# Altium schematic sheet design_1.SchDoc: design
size 414 x 279 mm; Date: 1/25/2021 11:39:22 PM; SheetNumber: 2; Origin: Eagle; GateName_1: G$1; SymbolName_1: A3-L-GUMSTIX; LibraryName: qualified_1; DeviceSetName: A3-L-GUMSTIX; A: A; B: B; C: C; D: D; E: E; F: F; G: G; H: H; 1: 1; 2: 2; 3: 3; 4: 4; 5: 5; Sheet: Sheet:; C:/Gumstix/gumstix-logo-16.bmp: C:/Gumstix/gumstix-logo-16.bmp; Board: Board:
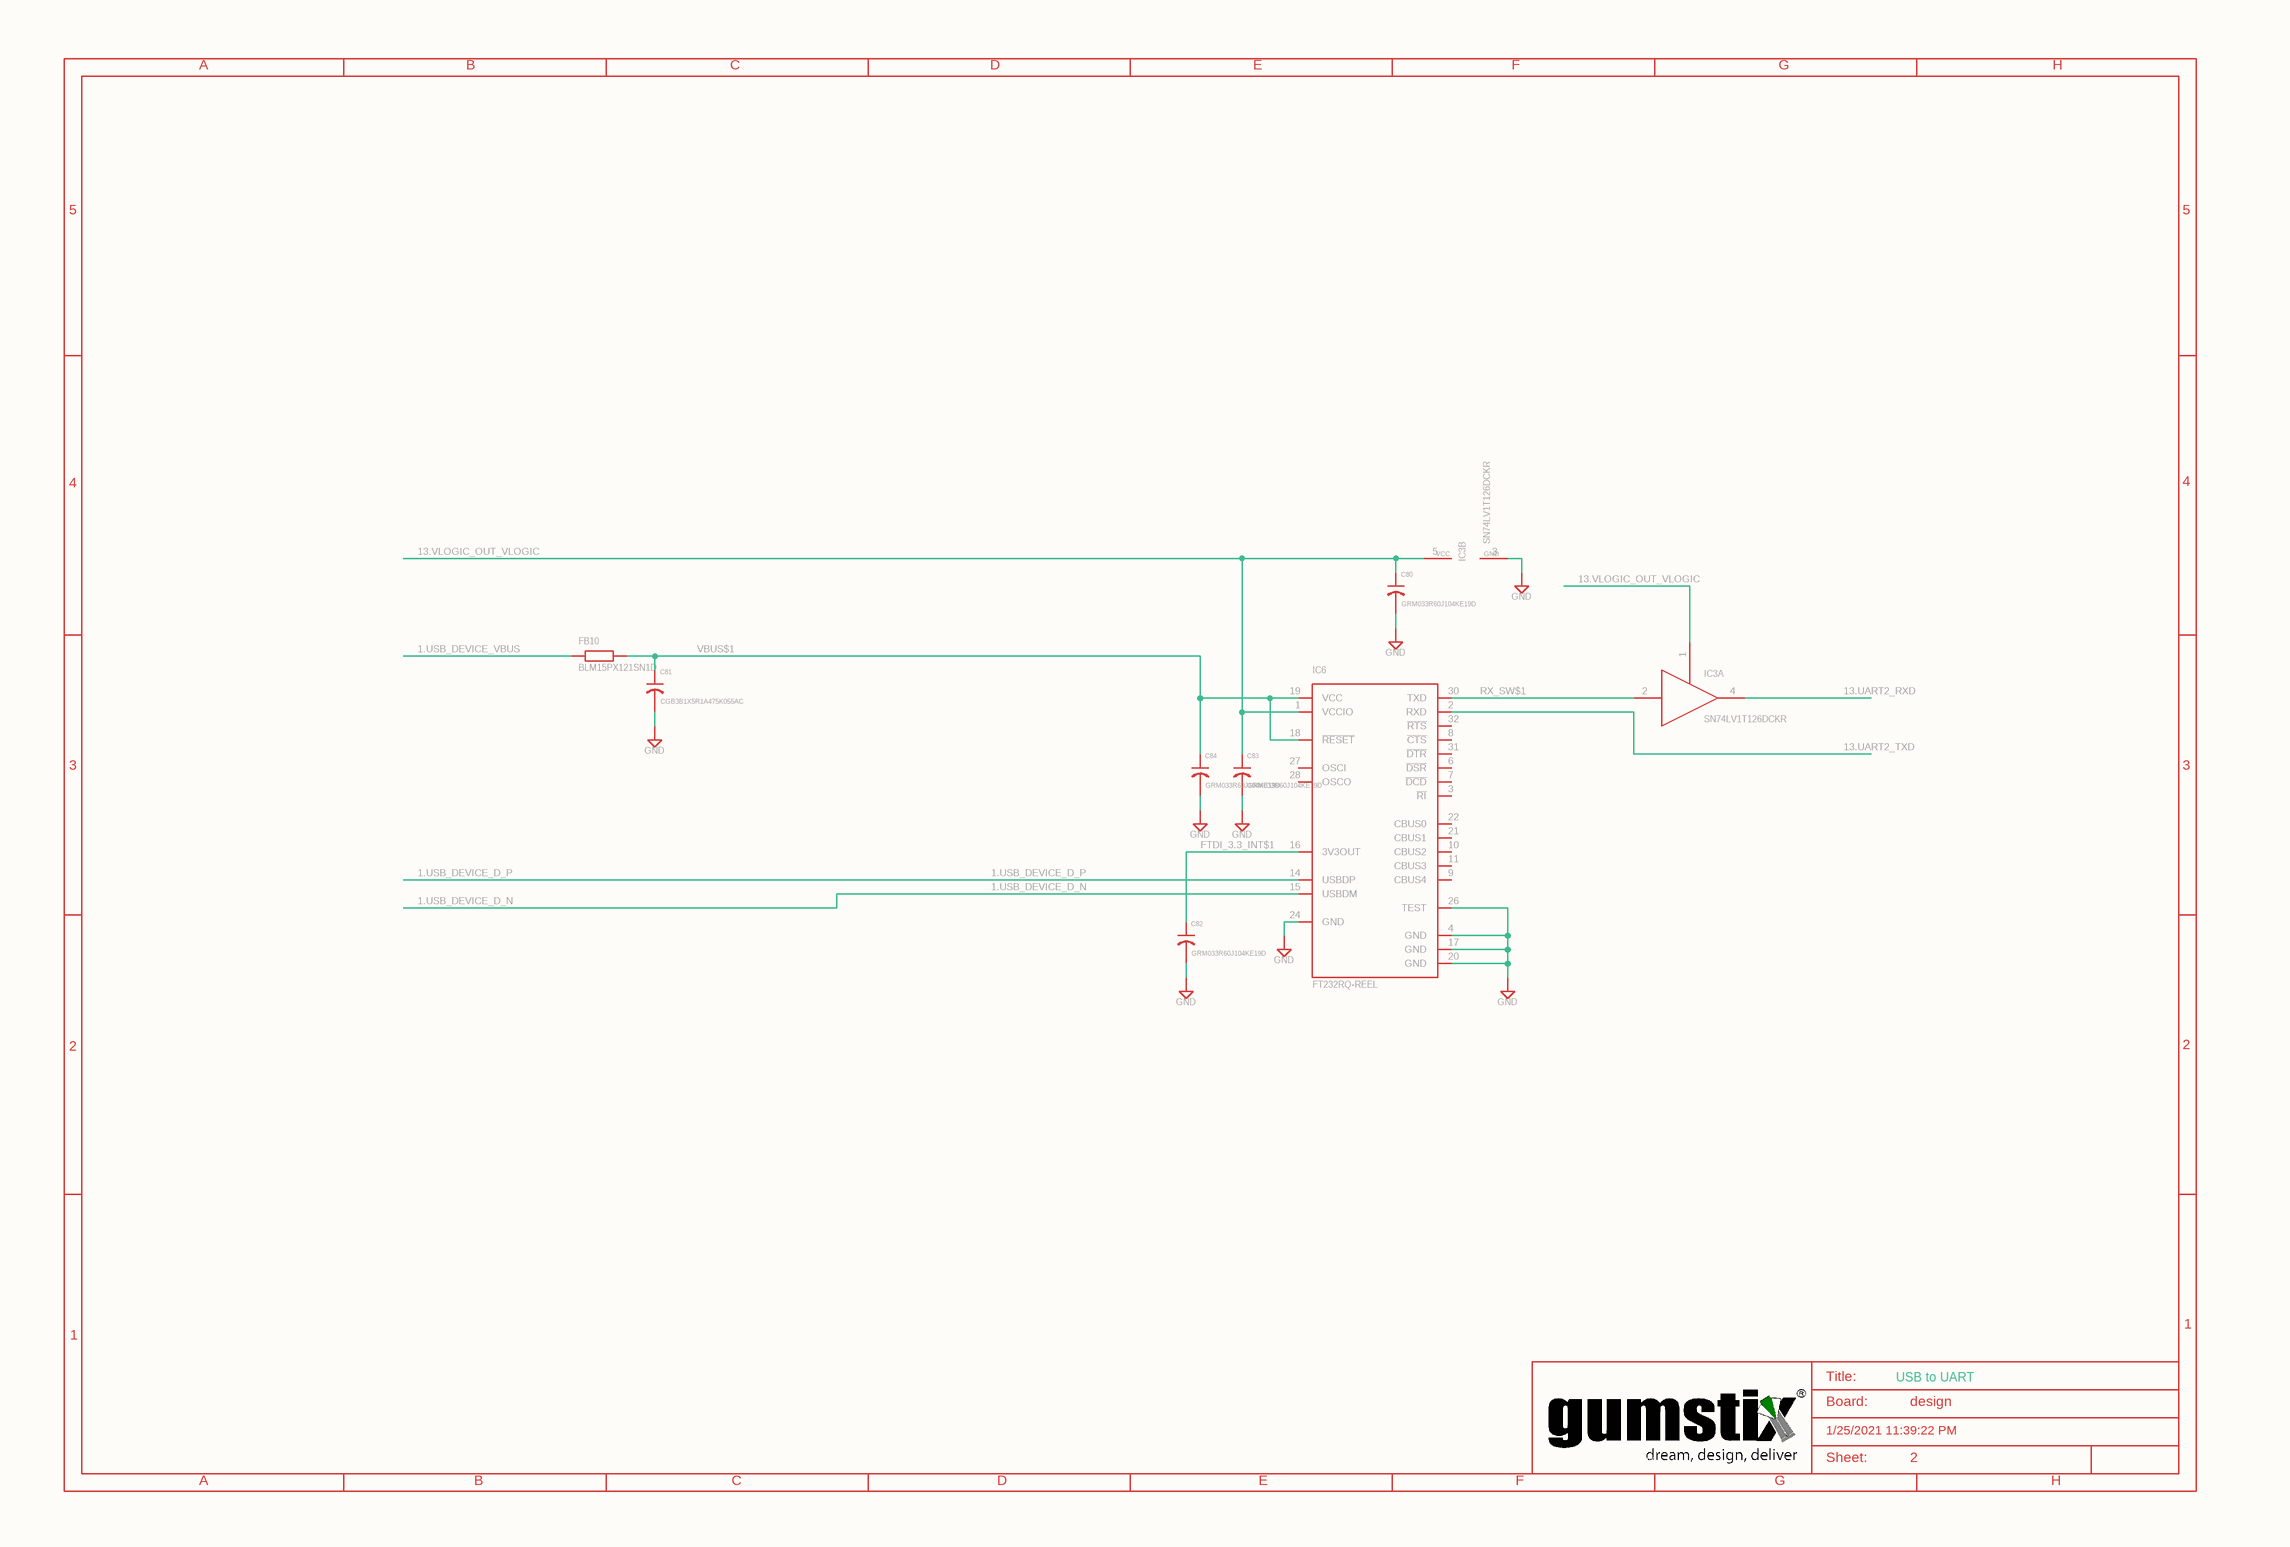
[diagram p0: design_1.SchDoc]

## Parts
C80  GRM033R60J104KE19D  [0201]
C81  CGB3B1X5R1A475K055AC  [0603]
C82  GRM033R60J104KE19D  [0201]
C83  GRM033R60J104KE19D  [0201]
C84  GRM033R60J104KE19D  [0201]
FB10  BLM15PX121SN1D  [0402]
IC3  SN74LV1T126DCKR  [SC70-5]  (parts A,B of 2)
IC6  FT232RQ-REEL  [QFN32]
SUPPLY83  GND
SUPPLY85  GND
SUPPLY86  GND
SUPPLY103  GND
SUPPLY104  GND
SUPPLY115  GND
SUPPLY133  GND
SUPPLY134  GND

## Nets
1.USB_DEVICE_D_N: IC6.15(USBDM)
1.USB_DEVICE_D_P: IC6.14(USBDP)
1.USB_DEVICE_VBUS: FB10.1
13.UART2_RXD: IC3.4(O)
13.UART2_TXD: IC6.2(RXD)
13.VLOGIC_OUT_VLOGIC: C80.1 C83.1 IC3.1(OE) IC3.5(VCC) IC6.1(VCCIO)
FTDI_3.3_INT$1: C82.1 IC6.16(3V3OUT)
RX_SW$1: IC3.2(I) IC6.30(TXD)
VBUS$1: C81.1 C84.1 FB10.2 IC6.18(~{RESET}) IC6.19(VCC)
NetC80_2: C80.2 SUPPLY115.?1(GND)
NetC81_2: C81.2 SUPPLY133.?1(GND)
NetC82_2: C82.2 SUPPLY83.?1(GND)
NetC83_2: C83.2 SUPPLY134.?1(GND)
NetC84_2: C84.2 SUPPLY86.?1(GND)
NetIC3_3: IC3.3(GND) SUPPLY85.?1(GND)
NetIC6_4: IC6.4(GND) IC6.17(GND) IC6.20(GND) IC6.26(TEST) SUPPLY104.?1(GND)
NetIC6_24: IC6.24(GND) SUPPLY103.?1(GND)

Not connected (* = marked no-connect by the designer): IC6 3(~{RI}) 6(~{DSR}) 7(~{DCD}) 8(~{CTS}) 9(CBUS4) 10(CBUS2) 11(CBUS3) 21(CBUS1) 22(CBUS0) 27(OSCI) 28(OSCO) 31(~{DTR}) 32(~{RTS})

## Notes on the sheet
- A
- B
- C
- D
- E
- F
- G
- H
- 5
- 4
- 3
- 2
- 1
- Title:
- Board:
- USB to UART
- design
- C:/Gumstix/gumstix-logo-16.bmp
- 1/25/2021 11:39:22 PM
- Sheet:

## Library data of the parts
C80 C82-C84 = GRM033R60J104KE19D: GateName_1: G$1; SymbolName_1: C-US; LibraryName: qualified_1; DeviceSetName: GRM033R60J104KE19D; DM: DM; DR: DR; DX: DX; DY: DY; HEIGHT: 0.25; SHEETNO: SHEETNO
C81 = CGB3B1X5R1A475K055AC: GateName_1: G$1; SymbolName_1: C-US; LibraryName: qualified_1; DeviceSetName: CGB3B1X5R1A475K055AC; DM: DM; DR: DR; DX: DX; DY: DY; HEIGHT: 0.5; SHEETNO: SHEETNO
FB10 = BLM15PX121SN1D: GateName_1: G$1; SymbolName_1: FB; LibraryName: qualified_1; DeviceSetName: BLM15PX121SN1D; DM: DM; DR: DR; DX: DX; DY: DY; HEIGHT: 0.35; SHEETNO: SHEETNO
IC3 = SN74LV1T126DCKR: Single Bus Buffer Gate With 3-State Outputs; GateName_1: A; SymbolName_1: 74126; GateName_2: P; SymbolName_2: PWRN; LibraryName: qualified_1; DeviceSetName: SN74LV1T126DCKR; DM: DM; DR: DR; DX: DX; DY: DY; HEIGHT: 1.1; SHEETNO: SHEETNO
IC6 = FT232RQ-REEL: Source: http://www.ftdichip.com/Documents/DataSheets/DS_FT232R_v104.pdf; GateName_1: 1; SymbolName_1: FT232R; LibraryName: qualified_1; DeviceSetName: FT232RQ-REEL; DM: DM; DR: DR; DX: DX; DY: DY; HEIGHT: 0.9; MF: MF; MPN: FT232RQ; OC_FARNELL: 1146033; OC_NEWARK: 91K9919; SHEETNO: SHEETNO
SUPPLY83 SUPPLY85 SUPPLY86 SUPPLY103 SUPPLY104 SUPPLY115 SUPPLY133 SUPPLY134 = GND: SUPPLY SYMBOL; SymbolName_1: GND-2; GateName_1: GND; LibraryName: qualified_1; DeviceSetName: GND